# Altium schematic sheet Input Power.SchDoc
size A; SheetNumber: 1; SheetTotal: 1
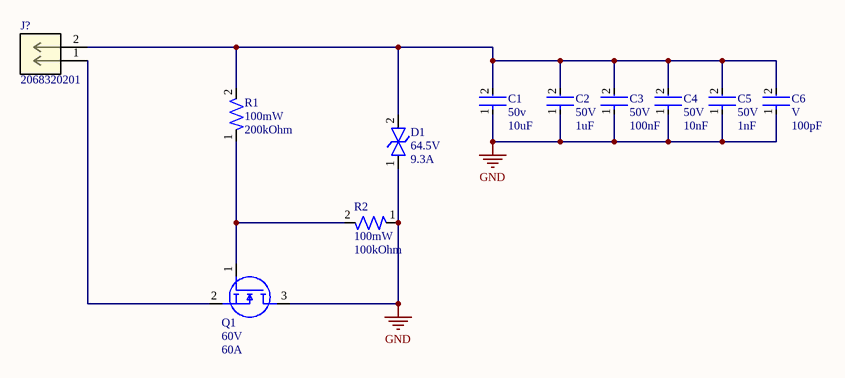
[diagram p0: Input Power.SchDoc]

## Parts
C1  Voltage Rating: 50v  Capacitance: 10uF  [CAP-0603]  (hidden comment: GRJ32ER71H106KE11L)
C2  Voltage Rating: 50V  Capacitance: 1uF  [CAP-0603]  (hidden comment: GRJ32ER71H106KE11L)
C3  Voltage Rating: 50V  Capacitance: 100nF  [CAP-0603]  (hidden comment: GCM188R71H104KA57D)
C4  Voltage Rating: 50V  Capacitance: 10nF  [CAP-0603]  (hidden comment: GRM1885C1H103JA01D)
C5  Voltage Rating: 50V  Capacitance: 1nF  [CAP-0603]  (hidden comment: GRM1885C1H102JA01D)
C6  Voltage Rating: V  Capacitance: 100pF  [CAP-0603]  (hidden comment: GRM1885C1H101JA01D)
D1  Voltage Rating: 64.5V  Current Rating: 9.3A  [DO-214AA (SMBJ)]  (hidden comment: SMBJ40CA)
J?  2068320201  [CONN_2068320000-SD_02_MOL]
Q1  Voltage: 60V  Continuous Current: 60A  [IC-8VSONCLIP]  (hidden comment: CSD18543Q3AT)
R1  Power: 100mW  Resistance: 200kOhm  [RES-0603]  (hidden comment: RC0603JR-07200KL)
R2  Wattage: 100mW  Resistance: 100kOhm  [RES-0603]  (hidden comment: RC0603FR-07100KL)

## Nets
GND: C1.1 C2.1 C3.1 C4.1 C5.1 C6.1 D1.1 Q1.3(D) R2.1
NetC1_2: C1.2 C2.2 C3.2 C4.2 C5.2 C6.2 D1.2 J?.2 R1.2
NetJ?_1: J?.1 Q1.2(S)
NetQ1_1: Q1.1(G) R1.1 R2.2

## Library data of the parts
C1-C6 = CAP 0603
D1 = DIO-TVS-0001: TVS DIODE 40VWM 64.5VC DO214AA; ComponentLink1Description: Datasheet; ComponentLink1URL: https://www.littelfuse.com/media?resourcetype=datasheets&itemid=09a6ae9a-73cb-4ac4-acac-e6dab92ab953&filename=littelfuse_tvs_diode_smbj_datasheet.pdf
J? = CONN MF+ 2 PIN VERT: Micro-Fit+ Vertical Header, Through Hole, 3.00mm Pitch, Dual Row, 2 Circuits, Tin (Sn) Plating, Glow-Wire Capable, Black, Tray; Manufacturer_Name: Molex Connector Corporation; Copyright: Copyright (C) 2025 Ultra Librarian. All rights reserved.; Manufacturer_Part_Number: 2068320201; RefDes: RefDes; Type: Type
Q1 = NMOS-60A-0001: MOSFET N-CH 60V 12A/60A 8VSON; ComponentLink2Description: Datasheet; ComponentLink2URL: http://www.ti.com/lit/ds/symlink/csd18543q3a.pdf
R1 R2 = RES 0603